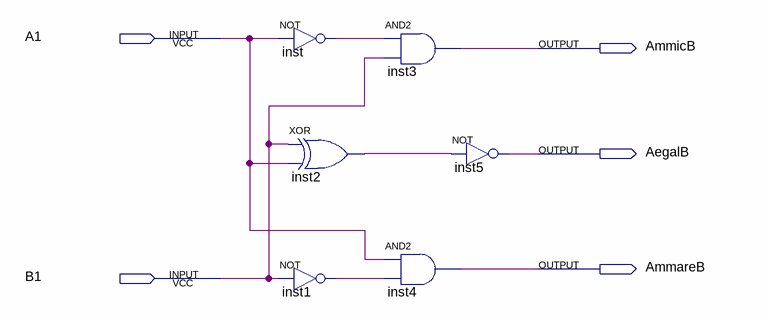
[diagram p0: schematic sheet]
// Quartus schematic Comp1bit.bdf as structural Verilog: 6 symbols, 5 pins
module Comp1bit (
  input  A1,
  input  B1,
  output AmmicB,
  output AegalB,
  output AmmareB
);

  wire inst1_out, inst2_out, inst_out;

  not inst (inst_out, A1);
  xor inst2 (inst2_out, B1, A1);
  not inst1 (inst1_out, B1);
  and inst3 (AmmicB, inst_out, B1);
  not inst5 (AegalB, inst2_out);
  and inst4 (AmmareB, A1, inst1_out);
endmodule
